# Altium schematic sheet CAPACITOR.SchDoc
size 420 x 297 mm; SheetNumber: 4; SheetTotal: 19
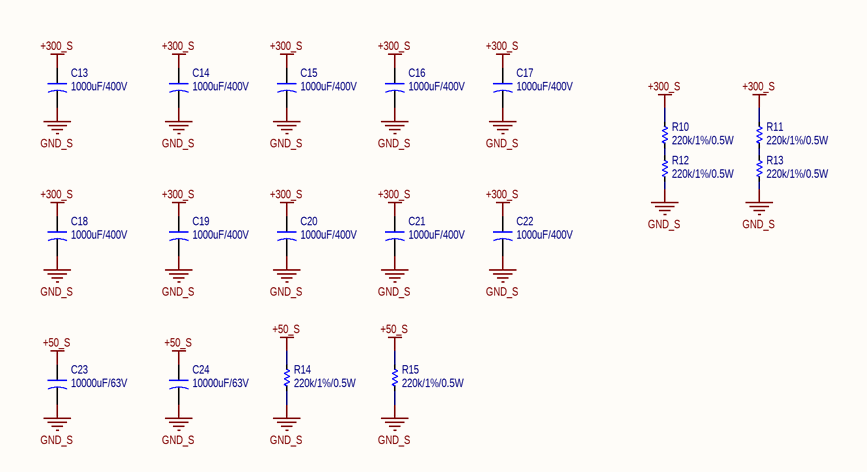
[diagram p0: CAPACITOR.SchDoc]

## Parts
C13  1000uF/400V  [CA-ALU-35x50]
C14  1000uF/400V  [CA-ALU-35x50]
C15  1000uF/400V  [CA-ALU-35x50]
C16  1000uF/400V  [CA-ALU-35x50]
C17  1000uF/400V  [CA-ALU-35x50]
C18  1000uF/400V  [CA-ALU-35x50]
C19  1000uF/400V  [CA-ALU-35x50]
C20  1000uF/400V  [CA-ALU-35x50]
C21  1000uF/400V  [CA-ALU-35x50]
C22  1000uF/400V  [CA-ALU-35x50]
C23  10000uF/63V  [CA-ALU-35x50]
C24  10000uF/63V  [CA-ALU-35x50]
R10  220k/1%/0.5W  [RES-SMD-2010]
R11  220k/1%/0.5W  [RES-SMD-2010]
R12  220k/1%/0.5W  [RES-SMD-2010]
R13  220k/1%/0.5W  [RES-SMD-2010]
R14  220k/1%/0.5W  [RES-SMD-2010]
R15  220k/1%/0.5W  [RES-SMD-2010]

## Nets
+50_S: C23.1 C24.1 R14.1 R15.1
+300_S: C13.1 C14.1 C15.1 C16.1 C17.1 C18.1 C19.1 C20.1 C21.1 C22.1 R10.1 R11.1
GND_S: C13.2 C14.2 C15.2 C16.2 C17.2 C18.2 C19.2 C20.2 C21.2 C22.2 C23.2 C24.2 R12.2 R13.2 R14.2 R15.2
NetR10_2: R10.2 R12.1
NetR11_2: R11.2 R13.1

## Notes on the sheet
- Project:
- Sub-system:
- Design by:
- Sheet title:
- Sheet
- of
- Checked by:
- Approved by:
- Document No:
- Revision:
- Size:
- Date:

## Library data of the parts
C13-C24 = CN-ALU-DIP: NO PN; Value: 104; LatestRevisionDate: 17-Jul-2002; LatestRevisionNote: Re-released for DXP Platform.; PackageReference: C1206; Publisher: Altium Limited
R10-R15 = Res-SMD: RES SMD 220K OHM 1% 1/2W 2010; Manufacturer: Generic Components; PN: CHV2010-FX-2203ELF; Class: Passive; Publisher: Altium Hobart Technology Centre